# Altium schematic sheet STM32_Peripherals.SchDoc
size A; SheetNumber: 10; SheetTotal: 10
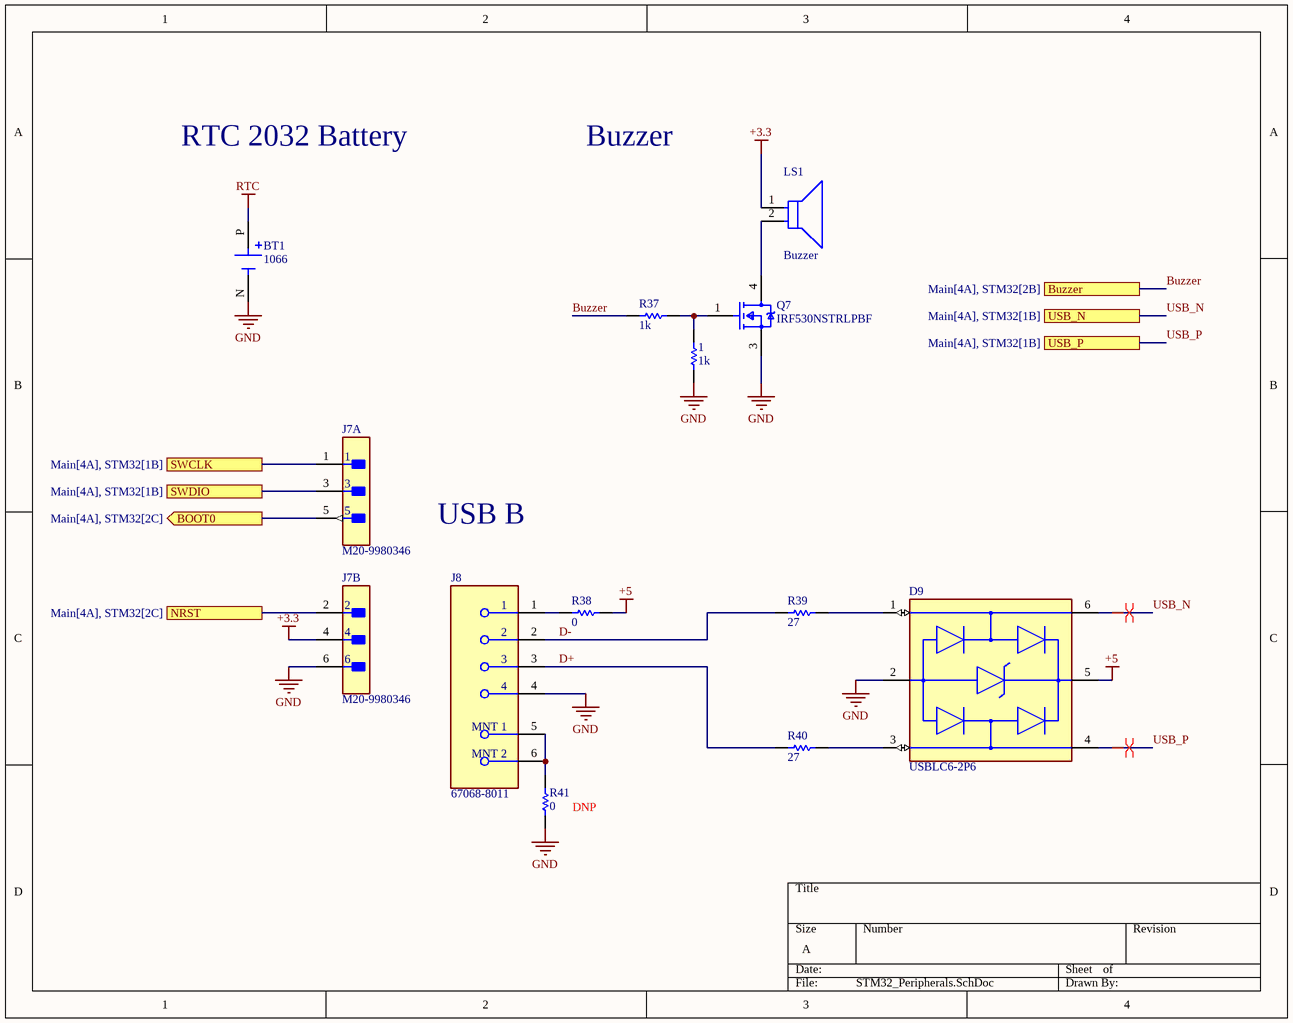
[diagram p0: STM32_Peripherals.SchDoc]

## Parts
1  1k  [RESC2013X50X30LL20T20]
BT1  1066  [BAT_1066]
D9  USBLC6-2P6  [FP-SOT-666-MFG]
J7  M20-9980346  [FP-M20-9980346-MFG]  (parts A,B of 2)
J8  67068-8011  [FP-67068-8011-MFG]
LS1  Buzzer  [FP-PKB24SPCH3601-B0-MFG]
Q7  IRF530NSTRLPBF  [FP-PG-TO263-3-MFG]
R37  1k  [RESC2013X50X30LL20T20]
R38  0  [RESC2013X50X30LL20T20]
R39  27  [RESC2013X50X30LL20T20]
R40  27  [RESC2013X50X30LL20T20]
R41  0  [RESC2013X50X30LL20T20]

## Ports
BOOT0 (out, see Main[4A], STM32[2C]), Buzzer (see Main[4A], STM32[2B]), NRST (see Main[4A], STM32[2C]), SWCLK (see Main[4A], STM32[1B]), SWDIO (see Main[4A], STM32[1B]), USB_N (see Main[4A], STM32[1B]), USB_P (see Main[4A], STM32[1B])

## Nets
+3.3: J7.4 LS1.1(C)
+5: D9.5(VBUS) R38.2
GND: 1.1 BT1.N(NEG) D9.2(GND) J7.6 J8.4 Q7.3(S) R41.1
RTC: BT1.P(POS)
BOOT0: J7.5 ; port BOOT0
Buzzer: R37.1 ; port Buzzer
D+: J8.3 R40.1
D-: J8.2 R39.1
NRST: J7.2 ; port NRST
SWCLK: J7.1 ; port SWCLK
SWDIO: J7.3 ; port SWDIO
USB_N: D9.6(I/O1) ; port USB_N
USB_P: D9.4(I/O2) ; port USB_P
Net1_2: 1.2 Q7.1(G) R37.2
NetD9_1: D9.1(I/O1) R39.2
NetD9_3: D9.3(I/O2) R40.2
NetJ8_1: J8.1 R38.1
NetJ8_5: J8.5(MNT_1) J8.6(MNT_2) R41.2
NetLS1_2: LS1.2(A) Q7.4(D)

## Layout directives
differential pair: USB_N, USB_P

## Notes on the sheet
- RTC 2032 Battery
- Buzzer
- USB B
- (near R41) DNP

## Library data of the parts
1 R37-R41 = CMP-2001-04896-1: Manufacturer: Vishay Dale; Part Number: CRCW08050000Z0EA
D9 = CMP-12225-000058-1: TVS DIODE 5.25V 17V SOT666; Min Breakdown Voltage: 6V; Power Line Protection: Yes; Element Configuration: Dual; Test Current: 1mA; Working Voltage: 5V; Number of Channels: 2; Max Reverse Leakage Current: 150nA; Direction: Unidirectional; Peak Pulse Current: 5A; Number of Elements: 1; Capacitance: 3.5pF; Max Breakdown Voltage: 6V; Height: 0.6mm; Depth: 1.3mm; Contact Plating: Tin; Reverse Breakdown Voltage: 6V; REACH SVHC: No SVHC; Operating Supply Voltage: 5V; Width: 1.3mm; Max Operating Temperature: 125°C; Reverse Standoff Voltage: 5V; ESD Protection: Yes; Package Quantity: 1; Termination: SMD/SMT; Length: 1.7mm; Leakage Current: 150nA; Number of Bidirectional Channels: 2; Case/Package: SOT-666; Min Operating Temperature: -40°C; Number of Pins: 6; Clamping Voltage: 17V; Breakdown Voltage: 6V; Lead Free: Lead Free; Radiation Hardening: No; Packaging: Tape and Reel; Mount: Surface Mount; Polarity: Unidirectional
J7 = CMP-2000-06636-2: CONN HEADER VERT 6POS 2.54MM; Manufacturer: Harwin; Current Rating: 3A; Number Of Contacts: 6; Conn Gender: Male; Conn Orientation: Vertical; Device Class L1: Connectors; ComponentLink2Description: Datasheet; Height: 8.99mm; Temperature Range High: +105°C; Contact Material: Tin,Nickel; RoHS: TRUE; Temperature Range Low: -40°C; ComponentLink2URL: https://cdn.harwin.com/pdfs/M20-998.pdf; Digikey Description: CONN HEADER VERT 6POS 2.54MM; Pitch: 2.54mm; Package: M20-9980346; Device Class L2: Headers and Wire Housings; Manufacturer Part Number: M20-9980346; Number Of Rows: 2; Category: Conn; Lead Free: Yes; Mouser Description: 2.54mm (0.1") Pitch DIL Vertical PC Tail Pin Header, 6.1mm mating pin height, tin, 3+3 contacts; Temperature: -40°C to +105°C; Device Class L3: unset; Octopart: https://octopart.com/m20-9980346-harwin-5436545; Automotive: No
J8 = CMP-00257-00942133-1: 67068-8011 Conn USB 2.0 Type B RCP 4 POS 2.5mm Solder RA Thru-Hole 4 Terminal 1 Port USB 2.0 Tray; NexarPartId: 942133; Number of Contacts: 4; Connector Type: Receptacle, USB; Gender: Receptacle; USB Standard: USB 2.0; Current Rating: 1.5A; Max Voltage Rating (AC): 30V; Number of Ports: 1; Lead Pitch: 2.5mm; Depth: 17mm; Length: 12mm; Orientation: Right Angle; Max Operating Temperature: 50°C; Termination: Solder; Number of Circuits: 4; REACH SVHC: Unknown; Schedule B: 8536695050; RoHS: Compliant; Voltage Rating: 30V; Number of Rows: 2; Number of Positions: 4; Housing Material: Nylon; Contact Plating: Gold; Height: 11.25mm; Number of Terminals: 4; Min Operating Temperature: 0°C; Mount: Through Hole; Pitch: 2.5mm; Radiation Hardening: No; Contact Material: Bronze, Gold, Nickel; Color: White
LS1 = CMP-06203-000001-2: AUDIO PIEZO TRANSDUCER 3-15V TH; Self Resonant Frequency: 3.6kHz; Voltage Rating (DC): 15V; Min Supply Voltage: 3V; Operating Supply Current: 16mA; Voltage Rating: 12V; Max Frequency: 4.1kHz; Washable: No; REACH SVHC: No SVHC; Packaging: Bulk; Frequency: 3.6kHz; Max Operating Temperature: 70°C; Max Supply Voltage: 15V; Max Supply Voltage (DC): 15V; Diameter: 24.3mm; Lead Free: Lead Free; Radiation Hardening: No; Nominal Supply Current: 16mA; Height: 9.7mm; Mount: Flush; Nominal Supply Voltage (DC): 12V; Min Operating Temperature: -20°C; Termination: PC Pins; Length: 24.3mm; Package Quantity: 650; Min Supply Voltage (DC): 3V; Max Supply Current: 16mA
Q7 = CMP-32901-000039-1: MOSFET N-CH 100V 17A D2PAK; Manufacturer: Infineon; Reverse Recovery Time: 93ns; Turn On Delay Time: 9.2ns; Number Of Channels: 1; Gate Charge At Vgs: 37nC @ 10V; Max Junction Temp: +175°C; Drain To Source Resistance: 90mΩ; Pulse Drain Current: 60A; Max Forward Diode Voltage: 1.3V; Threshold Vgs Min: 2V; Threshold Vgs Max: 4V; Depletion Mode: False; Rthja Max: 40°C/W; Reverse Recovery Charge: 320nC; Turn Off Delay Time: 35ns; Gate To Source Voltage: 20V; Power Dissipation: 3.8W; Standoff Height: 0mm; Input Capacitace At Vds: 920pF @ 25V; Height: 5.084mm; RoHS: TRUE; Device Class L2: Transistors; Lead Free: Yes; Automotive: No; Category: Trans; Footprint Url: https://www.infineon.com/cms/en/product/packages/PG-TO263/PG-TO263-3-901/; ComponentLink2Description: Datasheet; Temperature Range Low: -55°C; Drain To Source Voltage: 100V; Temperature: -55°C to +175°C; Device Class L1: Discrete Semiconductors; Number Of N Channels: 1; Continuous Drain Current: 17A; Temperature Range High: +175°C; Digikey Description: MOSFET N-CH 100V 17A D2PAK; Drain To Source Breakdown Voltage: 100V; ComponentLink2URL: https://www.infineon.com/dgdl/irf530nspbf.pdf?fileId=5546d462533600a4015355e38eb4199c; Manufacturer Part Number: IRF530NSTRLPBF; Device Class L3: MOSFETs; Octopart: https://octopart.com/irf530nstrlpbf-infineon-65873402; Package: PG-TO263-3
BT1 = 1066: Package: None; Price: None; Value: *; MP: 1066; Availability: Unavailable